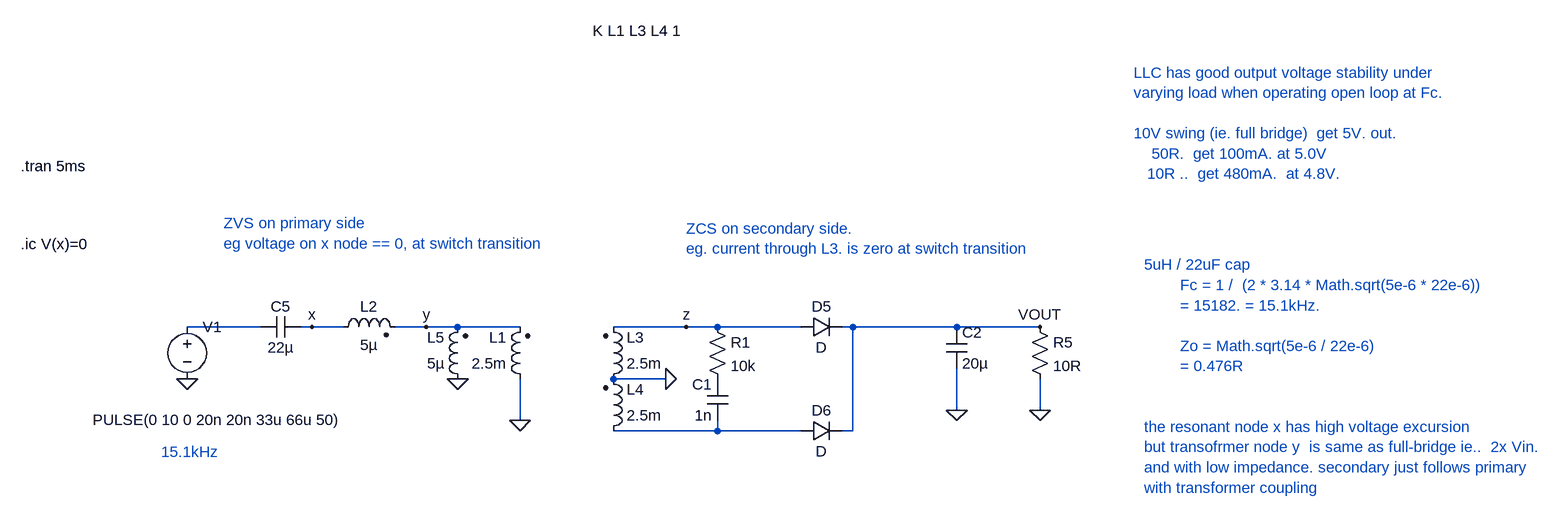
[diagram p0: schematic Draft205.asc]
Draft205.asc, the LTspice schematic file:
Version 4
SHEET 1 5720 1740
WIRE 512 0 400 0
WIRE 592 0 576 0
WIRE 640 0 592 0
WIRE 768 0 720 0
WIRE 816 0 768 0
WIRE 912 0 816 0
WIRE 1168 0 1056 0
WIRE 1216 0 1168 0
WIRE 1344 0 1216 0
WIRE 1424 0 1408 0
WIRE 1584 0 1424 0
WIRE 1712 0 1584 0
WIRE 1136 80 1056 80
WIRE 1584 128 1584 64
WIRE 1712 128 1712 80
WIRE 912 144 912 80
WIRE 1216 160 1216 144
WIRE 1216 160 1056 160
WIRE 1344 160 1216 160
WIRE 1424 160 1424 0
WIRE 1424 160 1408 160
FLAG 1712 128 0
FLAG 1136 80 0
FLAG 912 144 0
FLAG 1712 0 VOUT
FLAG 400 80 0
FLAG 1584 128 0
FLAG 592 0 x
FLAG 768 0 y
FLAG 1168 0 z
FLAG 816 80 0
SYMBOL ind2 928 96 R180
WINDOW 0 36 80 Left 2
WINDOW 3 36 40 Left 2
SYMATTR InstName L1
SYMATTR Value 2.5m
SYMATTR Type ind
SYMBOL ind2 1040 96 M180
WINDOW 0 36 80 Left 2
WINDOW 3 36 40 Left 2
SYMATTR InstName L3
SYMATTR Value 2.5m
SYMATTR Type ind
SYMBOL diode 1344 16 R270
WINDOW 0 32 32 VTop 2
WINDOW 3 0 32 VBottom 2
SYMATTR InstName D5
SYMBOL diode 1344 176 R270
WINDOW 0 32 32 VTop 2
WINDOW 3 0 32 VBottom 2
SYMATTR InstName D6
SYMBOL cap 1568 0 R0
SYMATTR InstName C2
SYMATTR Value 20µ
SYMBOL res 1696 -16 R0
SYMATTR InstName R5
SYMATTR Value 10R
SYMBOL ind2 1040 176 M180
WINDOW 0 36 80 Left 2
WINDOW 3 36 40 Left 2
SYMATTR InstName L4
SYMATTR Value 2.5m
SYMATTR Type ind
SYMBOL cap 576 -16 R90
WINDOW 0 0 32 VBottom 2
WINDOW 3 32 32 VTop 2
SYMATTR InstName C5
SYMATTR Value 22µ
SYMBOL ind2 624 16 R270
WINDOW 0 32 56 VTop 2
WINDOW 3 4 56 VBottom 2
SYMATTR InstName L2
SYMATTR Value 5µ
SYMATTR Type ind
SYMBOL voltage 400 -16 R0
WINDOW 123 0 0 Left 0
WINDOW 39 0 0 Left 0
WINDOW 3 -145 159 Left 2
SYMATTR Value PULSE(0 10 0 20n 20n 33u 66u 50)
SYMATTR InstName V1
SYMBOL cap 1232 144 R180
WINDOW 0 24 56 Left 2
WINDOW 3 24 8 Left 2
SYMATTR InstName C1
SYMATTR Value 1n
SYMBOL res 1200 -16 R0
SYMATTR InstName R1
SYMATTR Value 10k
SYMBOL ind2 832 96 R180
WINDOW 0 36 80 Left 2
WINDOW 3 36 40 Left 2
SYMATTR InstName L5
SYMATTR Value 5µ
SYMATTR Type ind
TEXT 144 -248 Left 2 !.tran 5ms
TEXT 1024 -456 Left 2 !K L1 L3 L4 1
TEXT 144 -128 Left 2 !.ic V(x)=0
TEXT 360 192 Left 2 ;15.1kHz
TEXT 1872 -96 Left 2 ;5uH / 22uF cap \n        Fc = 1 /  (2 * 3.14 * Math.sqrt(5e-6 * 22e-6))\n        = 15182. = 15.1kHz.\n \n        Zo = Math.sqrt(5e-6 / 22e-6)\n        = 0.476R\n \n \nthe resonant node x has high voltage excursion\nbut transofrmer node y  is same as full-bridge ie..  2x Vin.\nand with low impedance. secondary just follows primary\nwith transformer coupling
TEXT 1856 -392 Left 2 ;LLC has good output voltage stability under \nvarying load when operating open loop at Fc.\n \n10V swing (ie. full bridge)  get 5V. out.\n    50R.  get 100mA. at 5.0V\n   10R ..  get 480mA.  at 4.8V.
TEXT 456 -160 Left 2 ;ZVS on primary side\neg voltage on x node == 0, at switch transition
TEXT 1168 -152 Left 2 ;ZCS on secondary side.\neg. current through L3. is zero at switch transition

The netlist it stands for:
* Draft205.asc
L1 0 y 2.5m
L3 0 z 2.5m
D5 z VOUT D
D6 N002 VOUT D
C2 VOUT 0 20µ
R5 VOUT 0 10R
L4 N002 0 2.5m
C5 x N001 22µ
L2 x y 5µ
V1 N001 0 PULSE(0 10 0 20n 20n 33u 66u 50)
C1 N002 P001 1n
R1 z P001 10k
L5 0 y 5µ
.model D D
.lib standard.dio
.tran 5ms
K L1 L3 L4 1
.ic V(x)=0
* 15.1kHz
* 5uH / 22uF cap
*         Fc = 1 /  (2 * 3.14 * Math.sqrt(5e-6 * 22e-6))
*         = 15182. = 15.1kHz.
*         Zo = Math.sqrt(5e-6 / 22e-6)
*         = 0.476R
* the resonant node x has high voltage excursion
* but transofrmer node y  is same as full-bridge ie..  2x Vin.
* and with low impedance. secondary just follows primary
* with transformer coupling
* LLC has good output voltage stability under
* varying load when operating open loop at Fc.
* 10V swing (ie. full bridge)  get 5V. out.
*     50R.  get 100mA. at 5.0V
*    10R ..  get 480mA.  at 4.8V.
* ZVS on primary side
* eg voltage on x node == 0, at switch transition
* ZCS on secondary side.
* eg. current through L3. is zero at switch transition
.backanno
.end